# EAGLE design main (EAGLE 7.5.0)
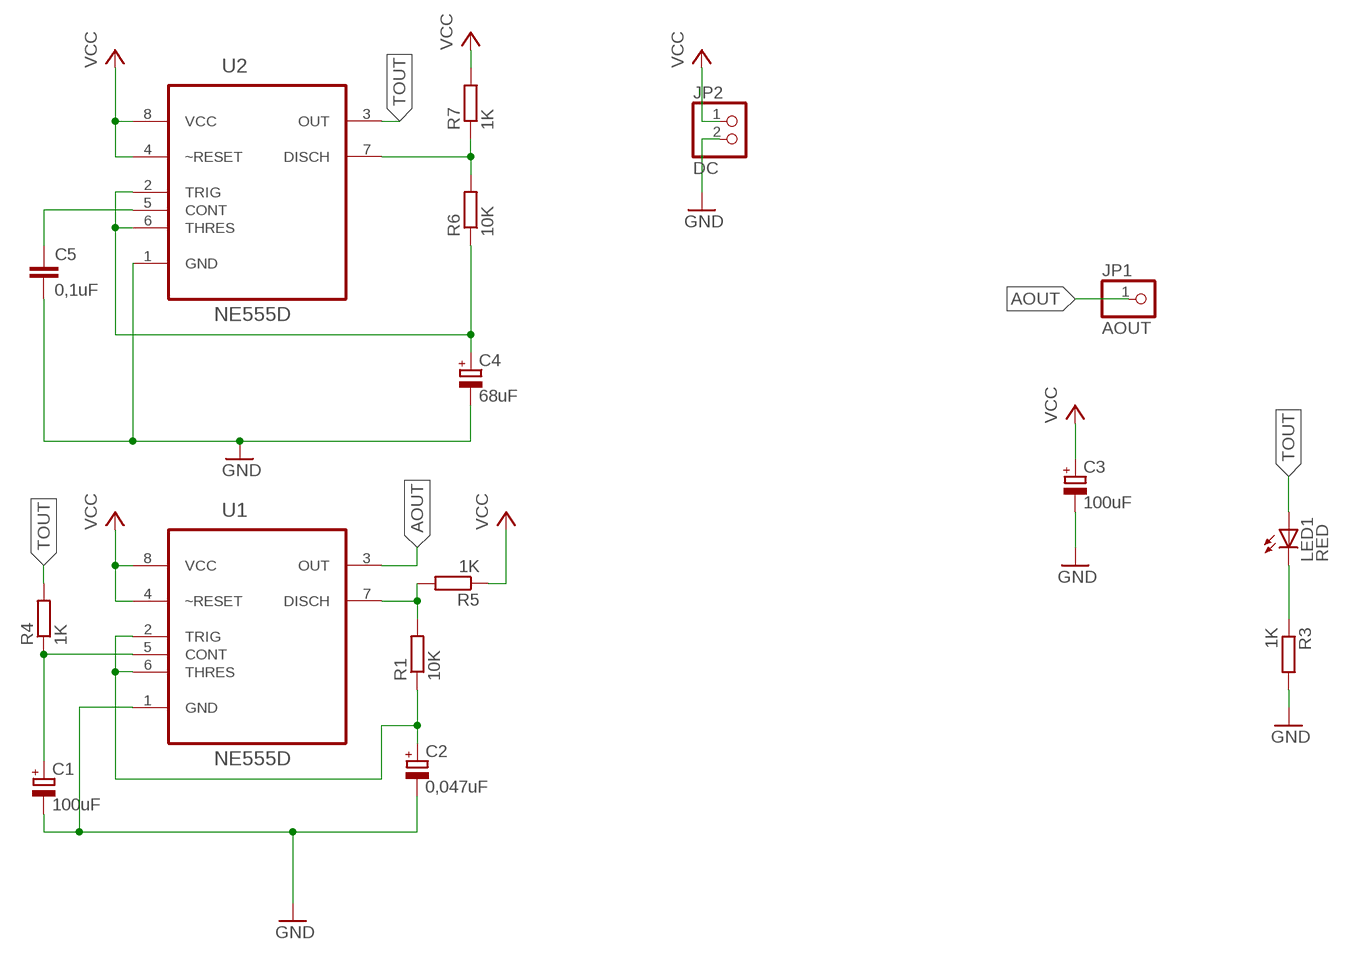
[diagram p0: schematic, sheet 1]

## Parts
C1  100uF  CPOL-EUE3.5-8  [E3,5-8]
C2  0,047uF  CPOL-EUE3.5-8  [E3,5-8]
C3  100uF  CPOL-EUE3.5-8  [E3,5-8]
C4  68uF  CPOL-EUE3.5-8  [E3,5-8]
C5  0,1uF  C-EU025-025X050  [C025-025X050]
JP1  AOUT  PINHD-1X1  [1X01]
JP2  DC  PINHD-1X2  [1X02]
LED1  RED  LEDCHIPLED_0805  [CHIPLED_0805]
R1  10K  R-EU_R0805  [R0805]
R3  1K  R-EU_R0805  [R0805]
R4  1K  R-EU_R0805  [R0805]
R5  1K  R-EU_R0805  [R0805]
R6  10K  R-EU_R0805  [R0805]
R7  1K  R-EU_R0805  [R0805]
U1  NE555D  [SOIC127P600X175-8N]
U2  NE555D  [SOIC127P600X175-8N]

## Nets
AOUT: JP1.1 U1.3(OUT)
GND: C1.- C2.- C3.- C4.- C5.2 JP2.2 R3.2 U1.1(GND) U2.1(GND)
N$2: R1.2 R5.2 U1.7(DISCH)
N$3: C5.1 U2.5(CONT)
N$4: C2.+ R1.1 U1.2(TRIG) U1.6(THRES)
N$5: C1.+ R4.1 U1.5(CONT)
N$6: R6.2 R7.1 U2.7(DISCH)
N$7: LED1.C R3.1
N$8: C4.+ R6.1 U2.2(TRIG) U2.6(THRES)
TOUT: LED1.A R4.2 U2.3(OUT)
VCC: C3.+ JP2.1 R5.1 R7.2 U1.4(~RESET) U1.8(VCC) U2.4(~RESET) U2.8(VCC)

## Library data of the parts
C1-C4 = resistor:CPOL-EU: POLARIZED CAPACITOR, European symbol
C5 = resistor:C-EU: CAPACITOR, European symbol
JP1 = pinhead:PINHD-1X1: PIN HEADER
JP2 = pinhead:PINHD-1X2: PIN HEADER
LED1 = led:LED: LED OSRAM: - CHIPLED LG R971, LG N971, LY N971, LG Q971, LY Q971, LO R971, LY R971 LH N974, LH R974 LS Q976, LO Q976, LY Q976 LO Q996 - Hyper CHIPLED LW Q18S LB Q993, LB Q99A, LB R99A - SideLED LS A670, LO A670, LY A670, LG A670, LP A670 LB A673, LV A673, LT A673, LW A673 LH A674 LY A675 LS A676, LA A676, LO A676, LY A676, LW A676 LS A679, LY A679, LG A679 - Hyper Micro SIDELED® LS Y876, LA Y876, LO Y876, LY Y876 LT Y87S - SmartLED LW L88C, LW L88S LB L89C, LB L89S, LG L890 LS L89K, LO L89K, LY L89K LS L896, LA L896, LO L896, LY L896 - TOPLED LS T670, LO T670, LY T670, LG T670, LP T670 LSG T670, LSP T670, LSY T670, LOP T670, LYG T670 LG T671, LOG T671, LSG T671 LB T673, LV T673, LT T673, LW T673 LH T674 LS T676, LA T676, LO T676, LY T676, LB T676, LH T676, LSB T676, LW T676 LB T67C, LV T67C, LT T67C, LS T67K, LO T67K, LY T67K, LW E67C LS E67B, LA E67B, LO E67B, LY E67B, LB E67C, LV E67C, LT E67C LW T67C LS T679, LY T679, LG T679 LS T770, LO T770, LY T770, LG T770, LP T770 LB T773, LV T773, LT T773, LW T773 LH T774 LS E675, LA E675, LY E675, LS T675 LS T776, LA T776, LO T776, LY T776, LB T776 LHGB T686 LT T68C, LB T68C - Hyper Mini TOPLED® LB M676 - Mini TOPLED Santana® LG M470 LS M47K, LO M47K, LY M47K Source: http://www.osram.convergy.de LUXEON: - LUMILED® LXK2-PW12-R00, LXK2-PW12-S00, LXK2-PW14-U00, LXK2-PW14-V00 LXK2-PM12-R00, LXK2-PM12-S00, LXK2-PM14-U00 LXK2-PE12-Q00, LXK2-PE12-R00, LXK2-PE12-S00, LXK2-PE14-T00, LXK2-PE14-U00 LXK2-PB12-K00, LXK2-PB12-L00, LXK2-PB12-M00, LXK2-PB14-N00, LXK2-PB14-P00, LXK2-PB14-Q00 LXK2-PR12-L00, LXK2-PR12-M00, LXK2-PR14-Q00, LXK2-PR14-R00 LXK2-PD12-Q00, LXK2-PD12-R00, LXK2-PD12-S00 LXK2-PH12-R00, LXK2-PH12-S00 LXK2-PL12-P00, LXK2-PL12-Q00, LXK2-PL12-R00 Source: www.luxeon.com KINGBRIGHT: KA-3528ASYC Source: www.kingbright.com
R1 R3-R7 = resistor:R-EU_: RESISTOR, European symbol
U1 U2 = Texas Instruments_By_element14_Batch_1:NE555D: PRECISION TIMER; MPN: NE555D; OC_FARNELL: 9589880; OC_NEWARK: 08F2512; PACKAGE: 8-SOIC; SUPPLIER: Texas Instruments

## Board
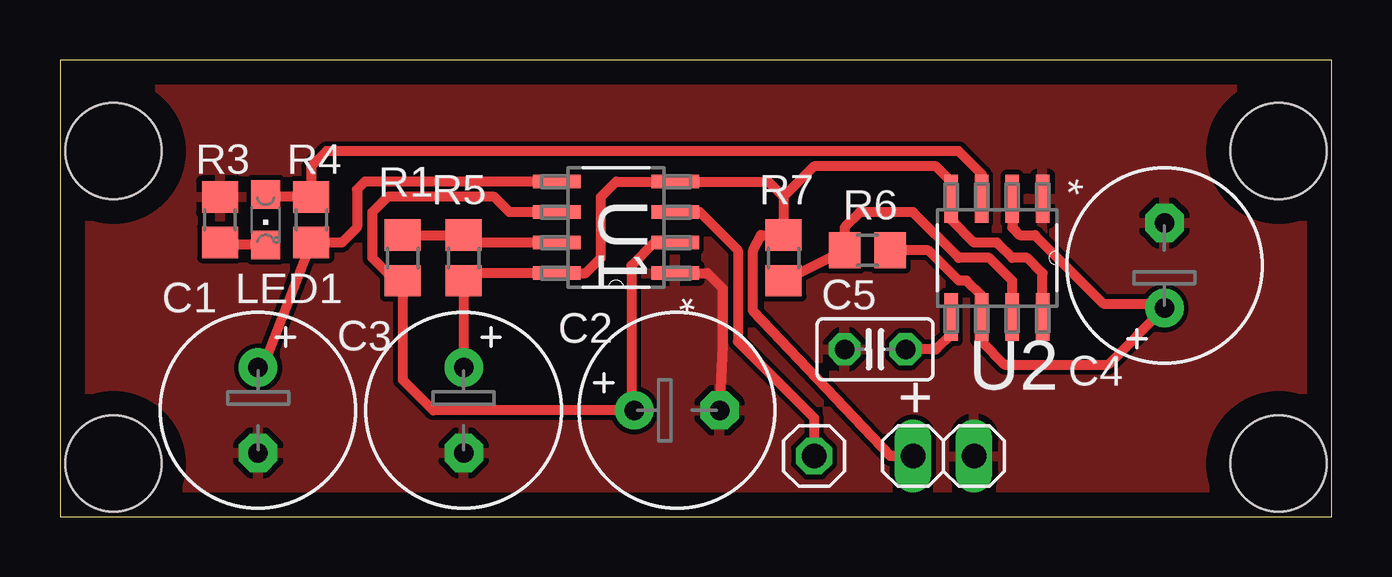
[diagram p1: board, top side]
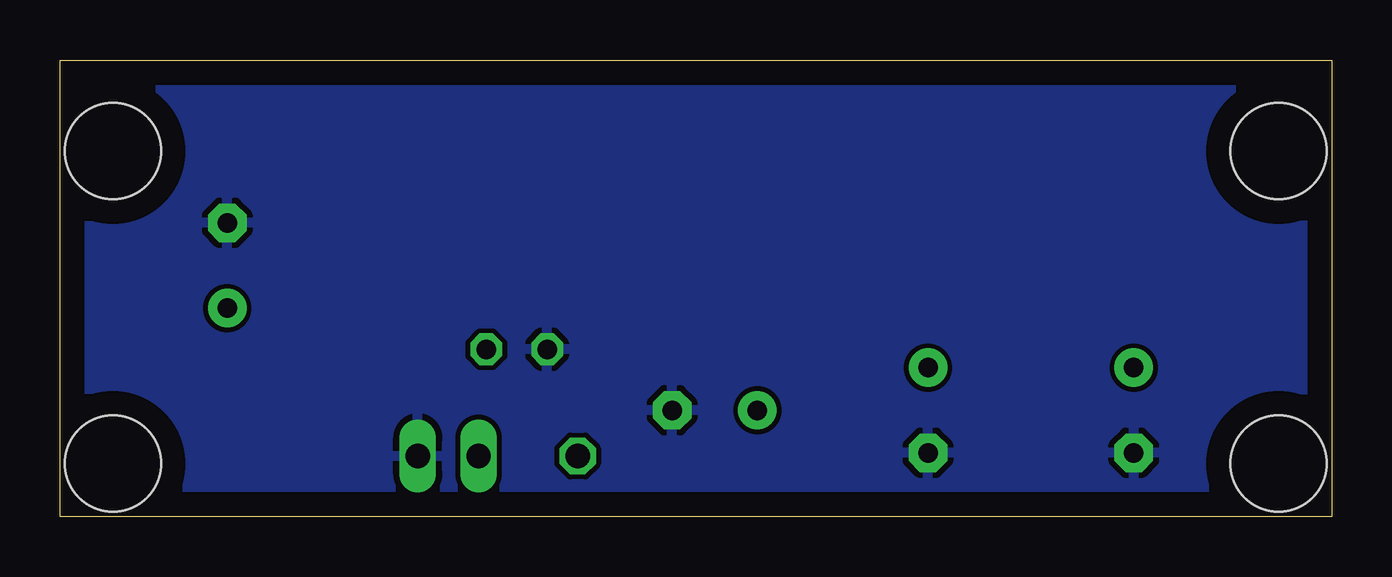
[diagram p2: board, bottom side, seen from below]

Size 53.01 x 19.04 mm. Coordinates in mm from the lower left corner, seen from the top.
Outline: 0,0 53.01,0 53.01,19.04 0,19.04 0,0
Copper layers (1*16): Top 0.035mm / dielectric 1.5mm / Bottom 0.035mm
Design rules "default": minimum track width 10mil, minimum drill 24mil, track to track 8mil, track to pad 8mil, pad to pad 8mil, via to via 8mil, smd to smd 8mil, copper to edge 40mil, drill to drill 8mil, minimum pad ring 10mil, minimum via ring 8mil, stop-mask expansion 4mil, vias tented up to drill 0mil, thermal gap 10mil
Holes 4 mm at 2.22,15.24 2.22,2.22 50.8,15.24 50.8,2.22

### Footprints (pad centres in the part's own frame; a part is rotated, then mirrored left to right if it is on the bottom)
E3,5-8 = drill 0.813 pad 1.6: + -1.778,0 | drill 0.813 pad 1.6 octagon: - 1.778,0
C025-025X050 = drill 0.813 octagon: 1 -1.27,0; 2 1.27,0
1X01 = drill 1.016 octagon: 1 0,0
1X02 = drill 1.016 long: 1 -1.27,0; 2 1.27,0
CHIPLED_0805 = smd 1.2 x 1.2: A 0,-1.05; C 0,1.05
R0805 = smd 1.3 x 1.5: 1 -0.95,0; 2 0.95,0
SOIC127P600X175-8N = smd 1.981 x 0.559: 1 -2.464,1.905; 2 -2.464,0.635; 3 -2.464,-0.635; 4 -2.464,-1.905; 5 2.464,-1.905; 6 2.464,-0.635; 7 2.464,0.635; 8 2.464,1.905

### Placement (x,y rotation side)
C1  8.26,4.45 270 top
C2  25.72,4.45 0 top
C3  16.83,4.45 270 top
C4  46.04,10.48 90 top
C5  33.97,6.99 180 top
JP1  31.43,2.54 0 top
JP2  36.83,2.54 0 top
LED1  8.57,12.38 180 top
R1  14.29,10.79 90 top
R3  6.67,12.38 90 top
R4  10.48,12.38 90 top
R5  16.83,10.79 90 top
R6  33.66,11.11 180 top
R7  30.16,10.79 90 top
U1  23.18,12.06 180 top
U2  39.05,10.79 270 top

### Tracks (layer width: path | path; a pad name or v marks a point on that pad's centre or on a via)
AOUT
  Top 0.406: U1.3 26.67,12.7 28.26,11.11 28.26,7.3 31.43,4.13 JP1.1
GND
  Top 0.406: U1.1 26.99,10.16 27.62,9.53 27.62,7.11 C2.-
  pour Bottom: 0,19.05 53.34,19.05 53.34,0 0,0
  pour Top: 0,19.05 53.34,19.05 53.34,0 0,0
N$2
  Top 0.406: U1.7 16.83,11.43 R5.2 R1.2
N$3
  Top 0.406: U2.5 37.15,7.62 36.51,6.99 C5.1
N$4
  Top 0.406: U1.2 24.77,11.43 23.81,10.48 23.81,4.57 C2.+ 15.56,4.45 14.29,5.71 R1.1 13.97,10.16 13.65,10.16 13.02,10.79 13.02,12.7 13.65,13.34 18.1,13.34 18.73,12.7 U1.6
N$5
  Top 0.406: C1.+ 8.57,6.54 R4.1 11.75,11.43 12.38,12.06 12.38,13.65 12.7,13.97 U1.5
N$6
  Top 0.406: R7.1 R6.2 32.7,12.06 33.34,12.7 35.56,12.7 37.47,10.79 38.73,10.79 39.69,9.84 U2.7
N$7
  Top 0.406: LED1.C 6.77,11.33 R3.1
N$8
  Top 0.406: R6.1 36.2,11.11 37.47,9.84 37.78,9.84 38.42,9.21 U2.6 38.42,7.3 39.37,6.35 43.69,6.35 C4.+ 45.85,8.89 43.5,8.89 40.64,11.75 40.01,11.75 39.69,12.06 U2.2
TOUT
  Top 0.406: U2.3 38.42,14.29 37.47,15.24 11.11,15.24 10.48,14.61 R4.2 8.67,13.33 LED1.A
VCC
  Top 0.406: C3.+ R5.1 16.83,10.16 U1.8 21.91,10.16 22.54,10.79 22.54,13.34 23.18,13.97 U1.4 29.53,13.97 30.16,13.34 | 30.16,13.34 31.43,14.61 36.51,14.61 37.15,13.97 U2.4 37.15,12.38 38.1,11.43 39.05,11.43 39.69,10.79 40.32,10.79 40.96,10.16 U2.8 | 30.16,13.34 R7.2 29.21,11.75 28.89,11.11 28.89,8.57 34.61,2.54 JP2.1

### Text on the board
tNames: +